# EAGLE design Battlebot_OSMC3 (EAGLE 5.06)
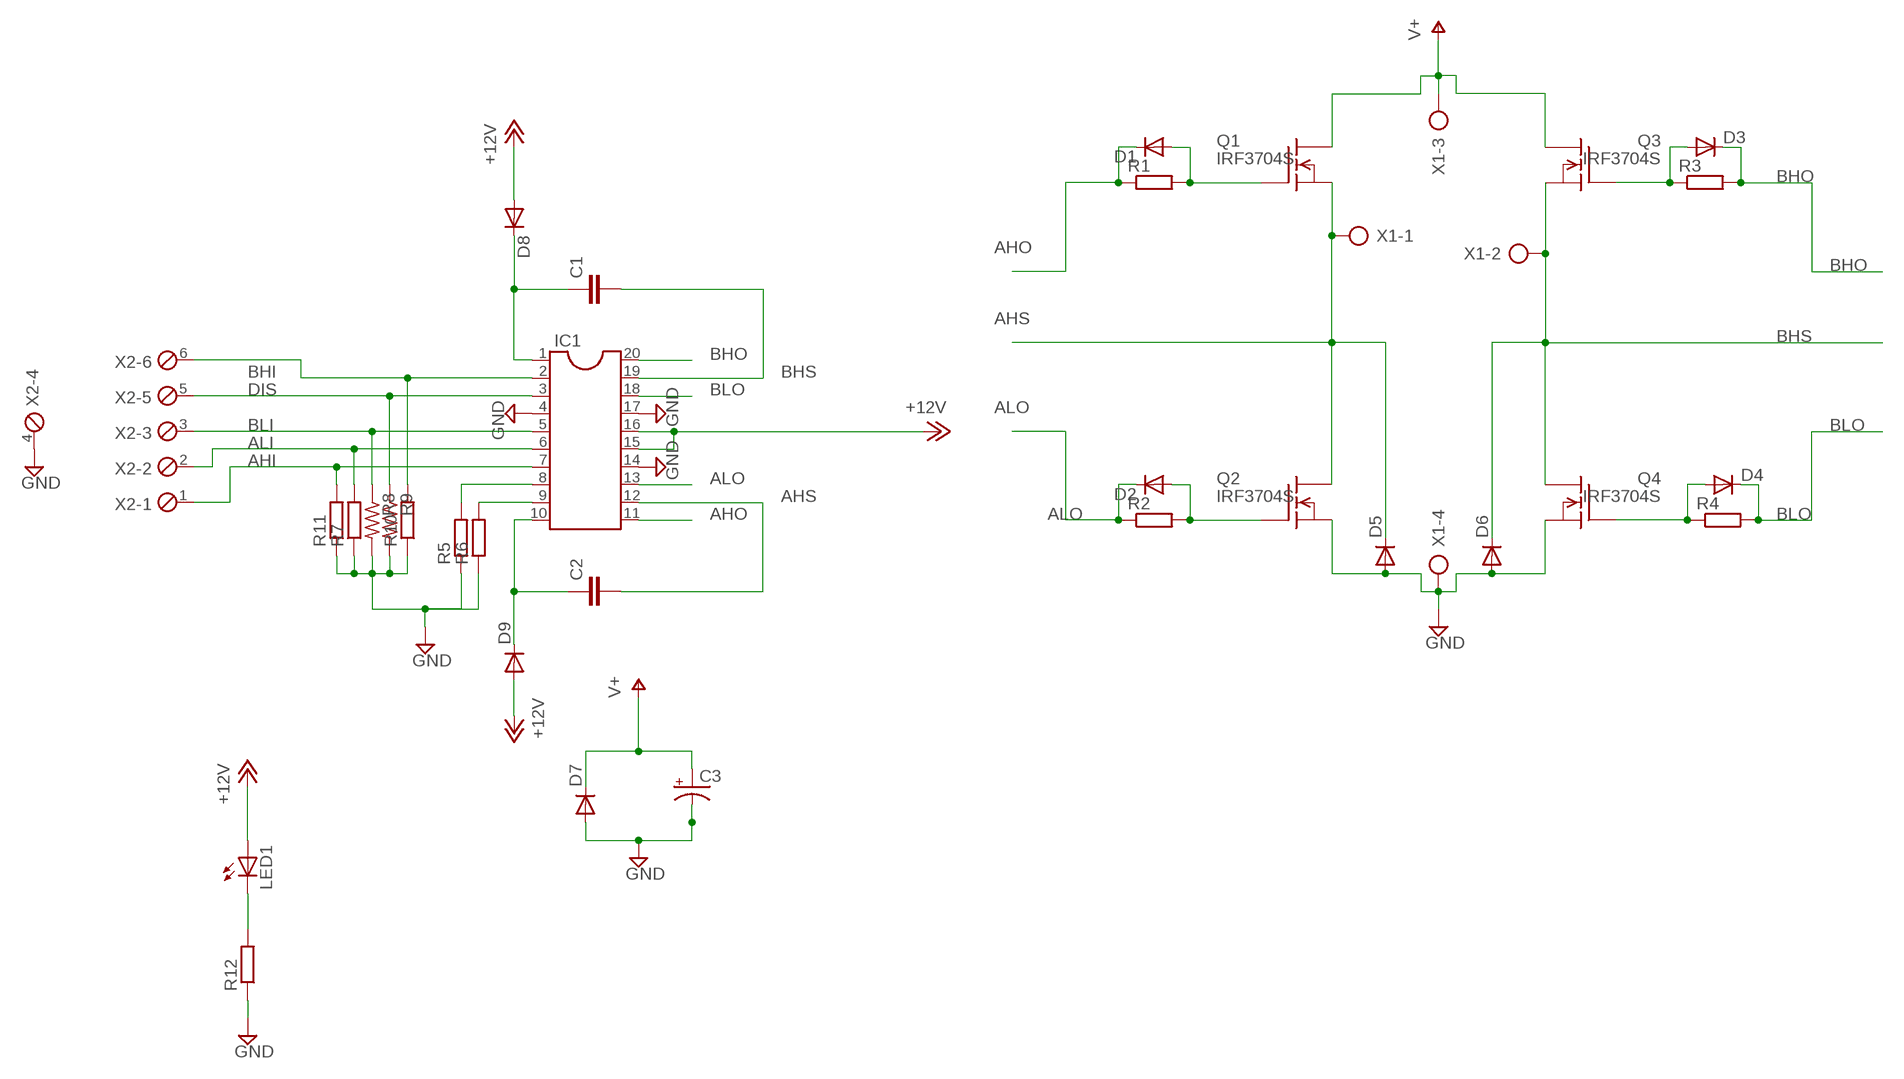
[diagram p0: schematic, sheet 1]

## Parts
C1  C7.5/3  [C7.5B3]
C2  C7.5/3  [C7.5B3]
C3  CPOL-USE5-10.5  [E5-10,5]
D1  DIODE-D-5  [D-5]
D2  DIODE-D-5  [D-5]
D3  DIODE-D-5  [D-5]
D4  DIODE-D-5  [D-5]
D5  DIODE-C1702-05  [C1702-05]
D6  DIODE-C1702-05  [C1702-05]
D7  DIODE-C1702-05  [C1702-05]
D8  1N4148DO35-7  [DO35-7]
D9  1N4148DO35-7  [DO35-7]
IC1  DIL20  [DIL20]
LED1  LED3MM  [LED3MM]
Q1  IRF3704S  BUZ325V  [TO218V]
Q2  IRF3704S  BUZ325V  [TO218V]
Q3  IRF3704S  BUZ325V  [TO218V]
Q4  IRF3704S  BUZ325V  [TO218V]
R1  R-EU_0204/5  [0204/5]
R2  R-EU_0204/5  [0204/5]
R3  R-EU_0204/5  [0204/5]
R4  R-EU_0204/5  [0204/5]
R5  R-EU_0204/5  [0204/5]
R6  R-EU_0204/5  [0204/5]
R7  R-EU_0204/5  [0204/5]
R8  R-US_0204/2V  [0204V]
R9  R-US_0204/2V  [0204V]
R10  R-EU_0204/5  [0204/5]
R11  R-EU_0204/5  [0204/5]
R12  R-EU_0204/5  [0204/5]
X1  AK500/4  [AK500/4]
X2  MPT6  [6POL254]

## Nets
+12V: D8.A D9.A IC1.15 IC1.16 LED1.A
AHI: IC1.7 R11.2 X2.1
AHO: D1.C IC1.11 R1.1
AHS: C2.2 D5.C IC1.12 Q1.3(S) Q2.2(D) X1.1
ALI: IC1.6 R7.2 X2.2
ALO: D2.C IC1.13 R2.1
BHI: IC1.2 R10.2 X2.6
BHO: D3.C IC1.20 R3.2
BHS: C1.2 D6.C IC1.19 Q3.3(S) Q4.2(D) X1.2
BLI: IC1.5 R8.1 X2.3
BLO: D4.C IC1.18 R4.2
DIS: IC1.3 R9.1 X2.5
GND: C3.- D5.A D6.A D7.A IC1.4 IC1.14 IC1.17 Q2.3(S) Q4.3(S) R5.1 R6.1 R7.1 R8.2 R9.2 R10.1 R11.1 R12.1 X1.4 X2.4
N$1: C2.1 D9.C IC1.10
N$2: C1.1 D8.C IC1.1
N$5: D1.A Q1.1(G) R1.2
N$6: D2.A Q2.1(G) R2.2
N$7: D4.A Q4.1(G) R4.1
N$8: D3.A Q3.1(G) R3.1
N$11: LED1.K(C) R12.2
N$14: IC1.8 R5.2
N$15: IC1.9 R6.2
V+: C3.+ D7.C Q1.2(D) Q3.2(D) X1.3

## Library data of the parts
C1 C2 = capacitor-wima:C: CAPACITOR naming: grid - package width
C3 = rcl:CPOL-US: POLARIZED CAPACITOR, American symbol
D1-D7 = diode:DIODE-: DIODE
D8 D9 = diode:1N4148: DIODE high speed (Philips)
IC1 = ic-package:DIL20: Dual In Line / Socket
LED1 = SparkFun:LED: LEDs Standard schematic elements and footprints for 5mm, 3mm, 1206, and 0603 sized LEDs. 5mm - Spark Fun Electronics SKU : COM-00529 (and others)
Q1-Q4 = transistor-fet:BUZ325: N-Channel Enhancement MOSFET 400V; 10,5A; 0,5Ohm
R1-R7 R10-R12 = rcl:R-EU_: RESISTOR, European symbol
R8 R9 = rcl:R-US_: RESISTOR, American symbol
X1 = con-ptr500:AK500/4: CONNECTOR
X2 = con-phoenix-254:MPT6: PHOENIX CONNECTOR

## Board
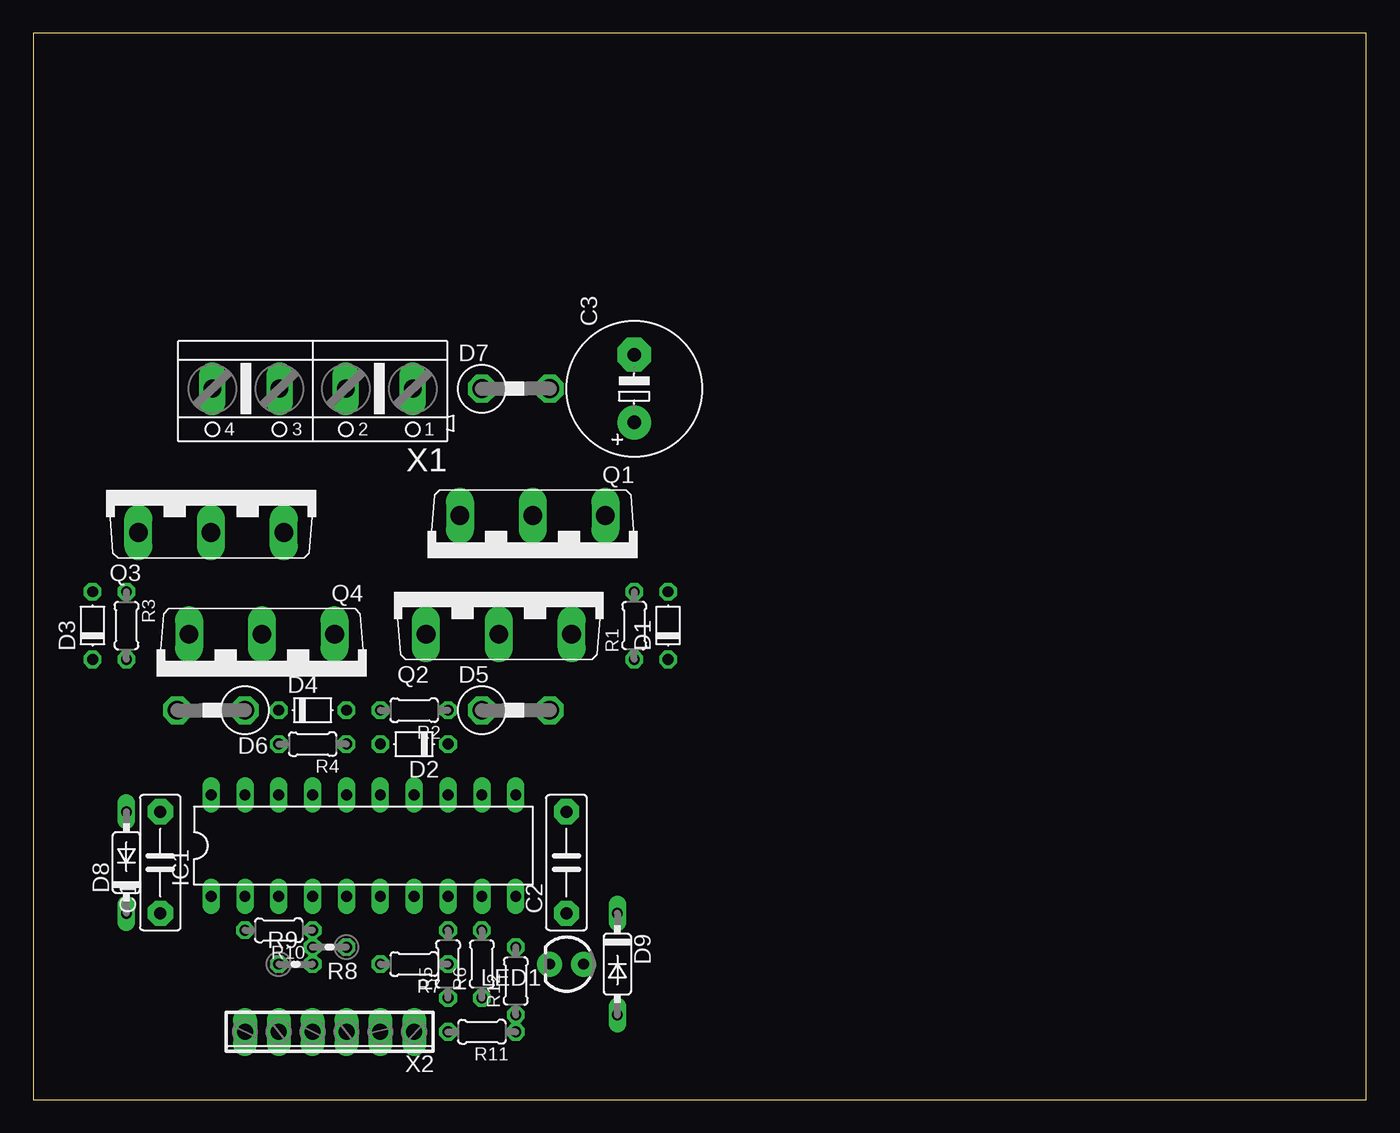
[diagram p1: board, top side]
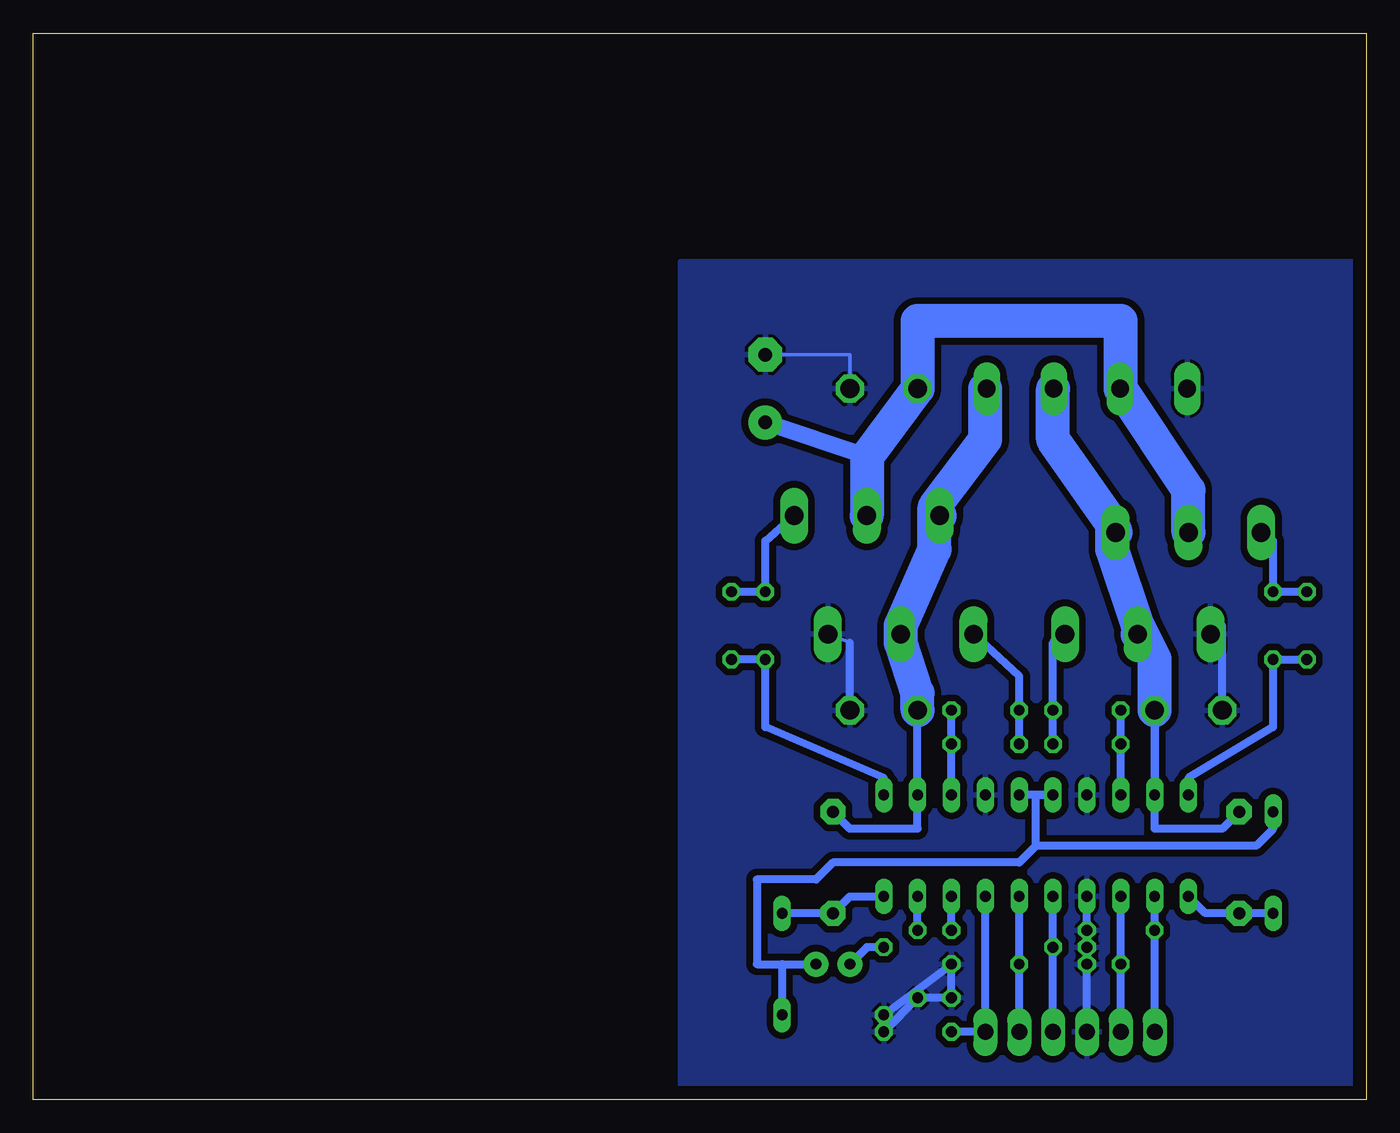
[diagram p2: board, bottom side, seen from below]

Size 100 x 80 mm. Coordinates in mm from the lower left corner, seen from the top.
Outline: 0,0 100,0 100,80 0,80 0,0
Copper layers (1*16): Top 0.035mm / dielectric 1.5mm / Bottom 0.035mm
Design rules "default *": minimum track width 10mil, minimum drill 24mil, track to track 20mil, track to pad 20mil, pad to pad 8mil, via to via 8mil, smd to smd 8mil, copper to edge 40mil, drill to drill 8mil, minimum pad ring 10mil, minimum via ring 8mil, stop-mask expansion 4mil, vias tented up to drill 0mil, thermal gap 10mil

### Footprints (pad centres in the part's own frame; a part is rotated, then mirrored left to right if it is on the bottom)
C7.5B3 = drill 0.914 pad 1.905 octagon: 1 -3.81,0; 2 3.81,0
E5-10,5 = drill 1.016 pad 2.54 round: + -2.54,0 | drill 1.016 pad 2.54 octagon: - 2.54,0
D-5 = drill 0.813 octagon: A 2.54,0; C -2.54,0
C1702-05 = drill 1.397 octagon: A 2.54,0; C -2.54,0
DO35-7 = drill 0.813 long: A 3.81,0; C -3.81,0
DIL20 = drill 0.813 long: 1 -11.43,-3.81; 2 -8.89,-3.81; 3 -6.35,-3.81; 4 -3.81,-3.81; 5 -1.27,-3.81; 6 1.27,-3.81; 7 3.81,-3.81; 8 6.35,-3.81; 9 8.89,-3.81; 10 11.43,-3.81; 11 11.43,3.81; 12 8.89,3.81; 13 6.35,3.81; 14 3.81,3.81; 15 1.27,3.81; 16 -1.27,3.81; 17 -3.81,3.81; 18 -6.35,3.81; 19 -8.89,3.81; 20 -11.43,3.81
LED3MM = drill 0.813 pad 1.88 round: A -1.27,0; K 1.27,0
TO218V = drill 1.397 long: 1 -5.461,-3.175; 2 0,-3.175; 3 5.461,-3.175
0204/5 = drill 0.813 octagon: 1 -2.54,0; 2 2.54,0
0204V = drill 0.813 octagon: 1 -1.27,0; 2 1.27,0
AK500/4 = drill 1.321 long: 1 -7.518,0; 2 -2.489,0; 3 2.489,0; 4 7.518,0
6POL254 = drill 1.2 pad 1.778 long: 1 -6.35,0; 2 -3.81,0; 3 -1.27,0; 4 1.27,0; 5 3.81,0; 6 6.35,0

### Placement (x,y rotation side)
C1  9.53,17.78 90 top
C2  40.01,17.78 90 top
C3  45.09,53.34 90 top
D1  47.62,35.56 90 top
D2  28.57,26.67 180 top
D3  4.45,35.56 90 top
D4  20.95,29.21 0 top
D5  36.2,29.21 0 top
D6  13.34,29.21 180 top
D7  36.2,53.34 0 top
D8  6.99,17.78 90 top
D9  43.81,10.16 270 top
IC1  24.77,19.05 0 top
LED1  40.01,10.16 180 top
Q1  37.47,40.64 180 top
Q2  34.92,38.1 0 top
Q3  13.34,45.72 0 top
Q4  17.14,31.75 180 top
R1  45.09,35.56 90 top
R2  28.57,29.21 180 top
R3  6.99,35.56 270 top
R4  20.95,26.67 180 top
R5  31.11,10.16 90 top
R6  33.66,10.16 90 top
R7  28.57,10.16 180 top
R8  22.23,11.43 180 top
R9  19.68,10.16 0 top
R10  18.41,12.7 180 top
R11  33.66,5.08 180 top
R12  36.2,8.89 90 top
X1  20.95,53.34 180 top
X2  22.23,5.08 180 top

### Tracks (layer width: path | path; a pad name or v marks a point on that pad's centre or on a via)
+12V
  Bottom 0.61: D8.A 6.99,20.32 8.26,19.05 24.77,19.05 | 24.77,19.05 24.77,22.86 IC1.16 IC1.15 | 45.72,10.16 43.81,10.16 D9.A | 24.77,19.05 26.04,17.78 40.01,17.78 41.27,16.51 45.72,16.51 45.72,10.16 | 45.72,10.16 LED1.A
AHI
  Bottom 0.61: R11.2 X2.1 IC1.7
AHO
  Bottom 0.61: IC1.11 36.2,24.13 45.09,27.94 R1.1 D1.C
AHS
  Bottom 0.254: 28.57,53.34 X1.1
  Bottom 0.61: D5.C IC1.12 33.66,20.32 38.73,20.32 C2.2
  Bottom 2.54: D5.C 33.66,30.48 34.92,34.29 Q2.2 34.92,35.56 32.38,41.27 32.38,44.45 | 32.38,44.45 28.57,49.53 28.57,53.34 | 32.38,44.45 Q1.3
ALI
  Bottom 0.61: IC1.6 R7.2 X2.2
ALO
  Bottom 0.61: IC1.13 D2.C R2.1
BHI
  Bottom 0.61: IC1.2 R10.2 X2.6
BHO
  Bottom 0.61: IC1.20 13.34,24.13 6.99,27.94 R3.2 | R3.2 D3.C R3.2
BHS
  Bottom 0.254: 23.5,53.34 X1.2
  Bottom 0.61: IC1.19 D6.C 15.88,20.32 10.79,20.32 C1.2
  Bottom 2.54: 23.5,53.34 23.5,49.53 19.05,43.18 | 19.05,43.18 Q3.3 | 19.05,43.18 19.05,41.27 17.14,35.56 | 17.14,35.56 Q4.2 | D6.C 15.88,33.02 17.14,35.56
BLI
  Bottom 0.61: IC1.5 R8.1 X2.3
BLO
  Bottom 0.61: IC1.18 R4.2 D4.C
DIS
  Bottom 0.61: X2.5 R9.1 IC1.3
GND
  Bottom 0.254: D7.A 38.73,55.88 C3.- | 38.73,34.29 Q2.3 | 10.79,35.56 Q4.3
  Bottom 0.61: R11.1 R6.1 R5.1 R7.1 R12.1 | IC1.4 R10.1 R8.2 R9.2 X2.4 | D5.A 38.73,34.29 | D6.A 10.79,35.56
  pour Bottom: 0.64,62.87 0.64,0.64 51.44,0.64 51.44,62.87
N$1
  Bottom 0.61: IC1.10 38.73,15.24 C2.1 D9.C
N$2
  Bottom 0.61: D8.C C1.1 12.06,13.97 IC1.1
N$5
  Bottom 0.254: R1.2 D1.A
  Bottom 0.61: D1.A R1.2 45.09,41.91 Q1.1
N$6
  Bottom 0.61: D2.A R2.2 26.04,31.75 Q2.1
N$7
  Bottom 0.61: R4.1 D4.A 23.5,34.29 Q4.1
N$8
  Bottom 0.61: D3.A R3.1 6.99,41.91 8.26,41.91 Q3.1
N$11
  Bottom 0.61: R12.2 37.47,11.43 LED1.K
N$14
  Bottom 0.61: R5.2 IC1.8
N$15
  Bottom 0.61: R6.2 IC1.9
V+
  Bottom 0.254: 18.41,53.34 X1.3
  Bottom 1.27: 37.47,48.26 C3.+
  Bottom 2.54: Q1.2 37.47,48.26 D7.C 33.66,58.42 18.41,58.42 18.41,53.34 13.34,45.72 Q3.2